# Altium project Control Box.PrjPcb
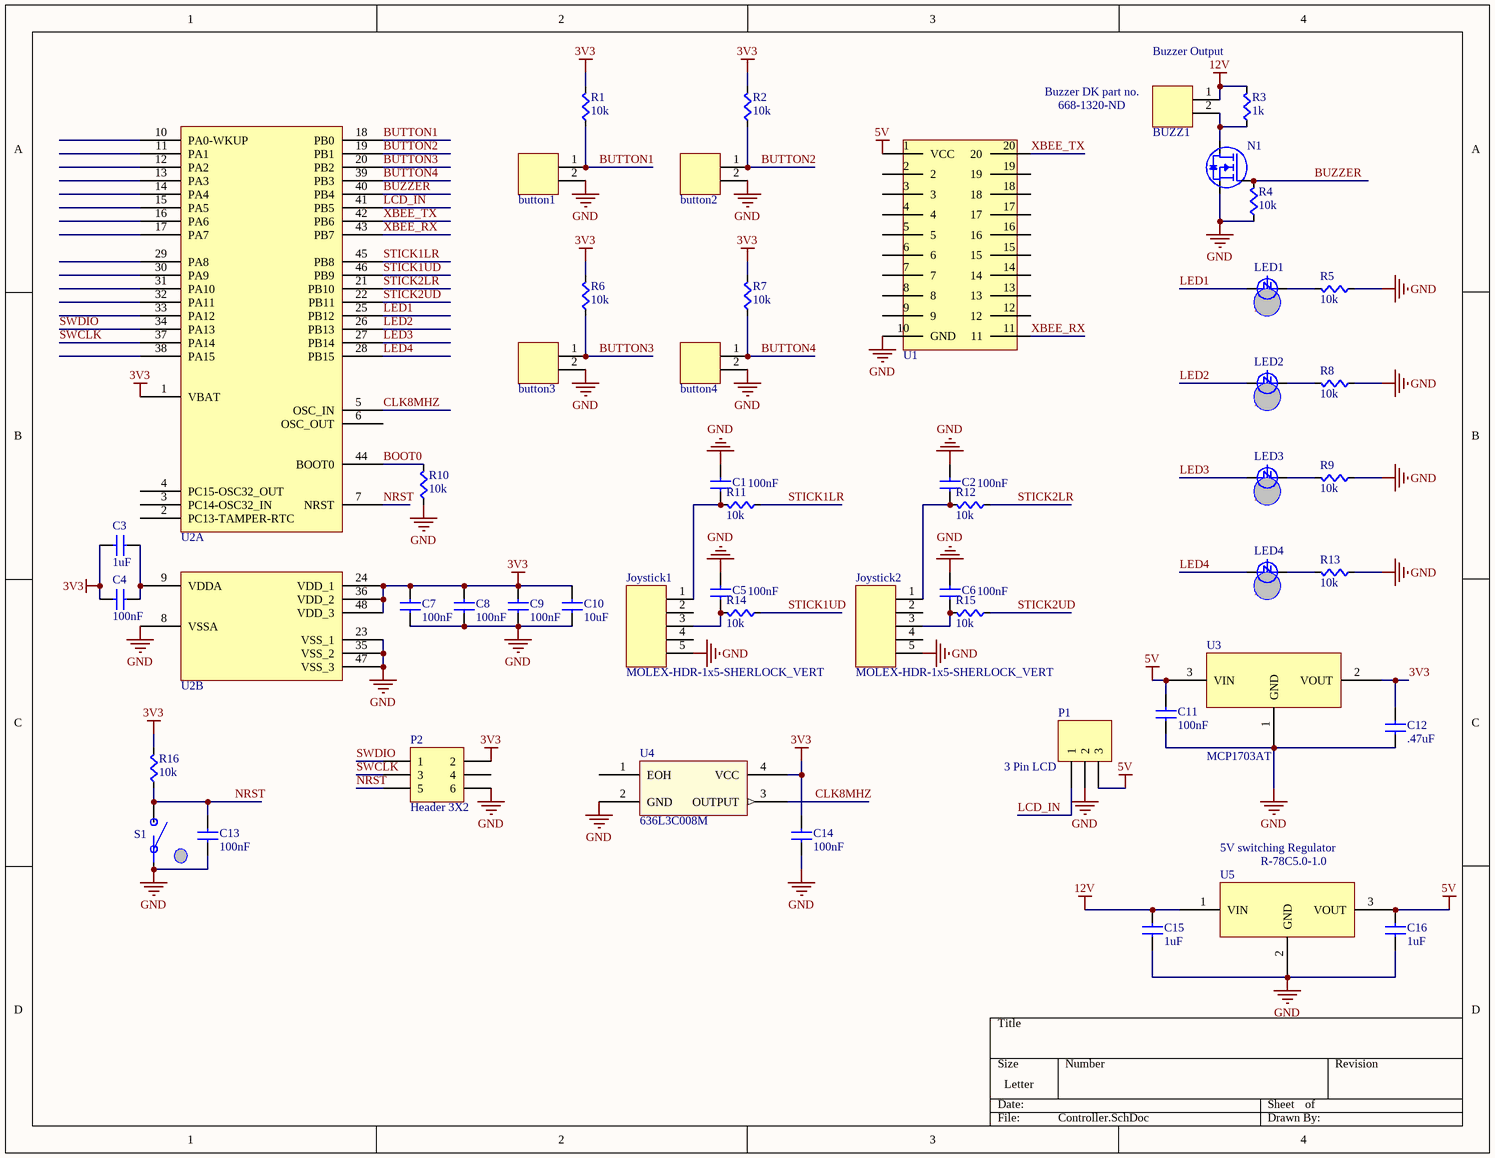
[diagram p0: Controller.SchDoc]
1 sheet, 52 parts. Net scope: global (net labels, ports and power ports of the same name join across sheets).
Board file: Controller.PcbDoc

## Sheet Controller.SchDoc
size Letter

### Parts
button1  2-pin Horz Sherlock  [MOLEX-HDR-1X2-SHERLOCK-HORZ]  (value not drawn)
button2  2-pin Horz Sherlock  [MOLEX-HDR-1X2-SHERLOCK-HORZ]  (value not drawn)
button3  2-pin Horz Sherlock  [MOLEX-HDR-1X2-SHERLOCK-HORZ]  (value not drawn)
button4  2-pin Horz Sherlock  [MOLEX-HDR-1X2-SHERLOCK-HORZ]  (value not drawn)
BUZZ1  2-pin Horz Sherlock  [MOLEX-HDR-1X2-SHERLOCK-HORZ]  (value not drawn)
C1  value 100nF  [CAPC0603]  (hidden comment: Cap)
C2  value 100nF  [CAPC0603]  (hidden comment: Cap)
C3  value 1uF  [CAPC0603]  (hidden comment: Cap)
C4  value 100nF  [CAPC0603]  (hidden comment: Cap)
C5  value 100nF  [CAPC0603]  (hidden comment: Cap)
C6  value 100nF  [CAPC0603]  (hidden comment: Cap)
C7  value 100nF  [CAPC0603]  (hidden comment: Cap)
C8  value 100nF  [CAPC0603]  (hidden comment: Cap)
C9  value 100nF  [CAPC0603]  (hidden comment: Cap)
C10  value 10uF  [CAPC1206]  (hidden comment: Cap)
C11  value 100nF  [CAPC1206]  (hidden comment: Cap)
C12  value .47uF  [CAPC1206]  (hidden comment: Cap)
C13  value 100nF  [CAPC0603]  (hidden comment: Cap)
C14  value 100nF  [CAPC0603]  (hidden comment: Cap)
C15  value 1uF  [CAPC1206]  (hidden comment: Cap)
C16  value 1uF  [CAPC1206]  (hidden comment: Cap)
Joystick1  MOLEX-HDR-1x5-SHERLOCK_VERT  [MOLEX-HDR-1X5-SHERLOCK-VERT]
Joystick2  MOLEX-HDR-1x5-SHERLOCK_VERT  [MOLEX-HDR-1X5-SHERLOCK-VERT]
LED1  Color: Red  [LED0603]  (hidden comment: LED)
LED2  Color: Red  [LED0603]  (hidden comment: LED)
LED3  Color: Red  [LED0603]  (hidden comment: LED)
LED4  Color: Red  [LED0603]  (hidden comment: LED)
N1  NMOSFET  [2N7002P,215]  (value not drawn)
P1  3 Pin LCD  [HDR1X3]
P2  Header 3X2  [HDR2X3]
R1  value 10k  [RES0603]  (hidden comment: Res)
R2  value 10k  [RES0603]  (hidden comment: Res)
R3  value 1k  [RES0603]  (hidden comment: Res)
R4  value 10k  [RES0603]  (hidden comment: Res)
R5  value 10k  [RES0603]  (hidden comment: Res)
R6  value 10k  [RES0603]  (hidden comment: Res)
R7  value 10k  [RES0603]  (hidden comment: Res)
R8  value 10k  [RES0603]  (hidden comment: Res)
R9  value 10k  [RES0603]  (hidden comment: Res)
R10  value 10k  [RES0603]  (hidden comment: Res)
R11  value 10k  [RES0603]  (hidden comment: Res)
R12  value 10k  [RES0603]  (hidden comment: Res)
R13  value 10k  [RES0603]  (hidden comment: Res)
R14  value 10k  [RES0603]  (hidden comment: Res)
R15  value 10k  [RES0603]  (hidden comment: Res)
R16  value 10k  [RES0603]  (hidden comment: Res)
S1  Button  [PTS645xxxxSMTR92]  (value not drawn)
U1  XBee  [XBee]  (value not drawn)
U2  STM32F103C8T7  [STM32F103C8T7]  (value not drawn)  (parts A,B of 2)
U3  MCP1703AT  [MCP1703AT-xx02EDB]
U4  636L3C008M  [636L3C]
U5  R-78C5.0-1.0  [R-78C5.0-1.0]

### Nets
3V3: C3.2(B) C4.2(B) C7.1(A) C8.1(A) C9.1(A) C10.2(B) C12.1(A) C14.1(A) P2.2 R1.1(A) R2.1(A) R6.1(A) R7.1(A) R16.1(A) U2.1(VBAT) U2.24(VDD_1) U2.36(VDD_2) U2.48(VDD_3) U3.2(VOUT) U4.4(VCC)
5V: C11.1(A) C16.1(A) P1.3 U1.1(VCC) U3.3(VIN) U5.3(VOUT)
12V: BUZZ1.1 C15.1(A) R3.1(A) U5.1(VIN)
GND: button1.2 button2.2 button3.2 button4.2 C1.1(A) C2.1(A) C5.1(A) C6.1(A) C7.2(B) C8.2(B) C9.2(B) C10.1(A) C11.2(B) C12.2(B) C13.2(B) C14.2(B) C15.2(B) C16.2(B) Joystick1.5 Joystick2.5 N1.2(S) P1.2 P2.6 R4.2(B) R5.2(B) R8.2(B) R9.2(B) R10.2(B) R13.2(B) S1.A U1.10(GND) U2.8(VSSA) U2.23(VSS_1) U2.35(VSS_2) U2.47(VSS_3) U3.1(GND) U4.2(GND) U5.2(GND)
BOOT0: R10.1(A) U2.44(BOOT0)
BUTTON1: button1.1 R1.2(B) U2.18(PB0)
BUTTON2: button2.1 R2.2(B) U2.19(PB1)
BUTTON3: button3.1 R6.2(B) U2.20(PB2)
BUTTON4: button4.1 R7.2(B) U2.39(PB3)
BUZZER: N1.1(G) R4.1(A) U2.40(PB4)
CLK8MHZ: U2.5(OSC_IN) U4.3(OUTPUT)
LCD_IN: P1.1 U2.41(PB5)
LED1: LED1.A U2.25(PB12)
LED2: LED2.A U2.26(PB13)
LED3: LED3.A U2.27(PB14)
LED4: LED4.A U2.28(PB15)
NRST: C13.1(A) P2.5 R16.2(B) S1.B U2.7(NRST)
STICK1LR: R11.2(B) U2.45(PB8)
STICK1UD: R14.2(B) U2.46(PB9)
STICK2LR: R12.2(B) U2.21(PB10)
STICK2UD: R15.2(B) U2.22(PB11)
SWCLK: P2.3 U2.37(PA14)
SWDIO: P2.1 U2.34(PA13)
XBEE_RX: U1.11 U2.43(PB7)
XBEE_TX: U1.20 U2.42(PB6)
NetBUZZ1_2: BUZZ1.2 N1.3(D) R3.2(B)
NetC1_2: C1.2(B) Joystick1.1 R11.1(A)
NetC2_2: C2.2(B) Joystick2.1 R12.1(A)
NetC3_1: C3.1(A) C4.1(A) U2.9(VDDA)
NetC5_2: C5.2(B) Joystick1.3 R14.1(A)
NetC6_2: C6.2(B) Joystick2.3 R15.1(A)
NetLED1_C: LED1.C R5.1(A)
NetLED2_C: LED2.C R8.1(A)
NetLED3_C: LED3.C R9.1(A)
NetLED4_C: LED4.C R13.1(A)

Not connected (* = marked no-connect by the designer): Joystick1 2 4; Joystick2 2 4; P2 4; U1 2 3 4 5 6 7 8 9 12 13 14 15 16 17 18 19; U2 2(PC13-TAMPER-RTC) 3(PC14-OSC32_IN) 4(PC15-OSC32_OUT) 6(OSC_OUT) 10(PA0-WKUP) 11(PA1) 12(PA2) 13(PA3) 14(PA4) 15(PA5) 16(PA6) 17(PA7) 29(PA8) 30(PA9) 31(PA10) 32(PA11) 33(PA12) 38(PA15); U4 1(EOH)

### Notes on the sheet
- (near BUZZ1) Buzzer DK part no.
- Buzzer Output
- 668-1320-ND
- 5V switching Regulator

### Library data of the parts
button1-button4 BUZZ1 = MOLEX-HDR-1x2-SHERLOCK_RA: Header, Molex, 2mm Pitch Sherlock Header, Single Row, Horizontal, 2 Circuits, Length 3.3mm,  0353630260; Manufacturer: Molex Inc; Manufacturer Part Number: 0353630260; Supplier Part Number: WM18931-ND; Supplier: Digi-Key
Joystick1 Joystick2 = MOLEX-HDR-1x5-SHERLOCK_VERT: Header, Molex, 2mm Pitch Sherlock Header, Single Row, Vertical, 5 Circuits, Length 3.3mm, 0353620550; Manufacturer Part Number: *; Order Part Number: *
N1 = NMOSFET: NMOSFET Template; Supplier 1: Digi-Key; Supplier Part Number 1: 568-5818-1-ND
P1 = Header 3: NHD-0420D3Z-NSW-BBW-V3-ND; LatestRevisionDate: 17-Jul-2002; LatestRevisionNote: Re-released for DXP Platform.; Publisher: Altium Limited
P2 = Header 3X2: Header, 3-Pin, Dual row; LatestRevisionDate: 17-Jul-2002; LatestRevisionNote: Re-released for DXP Platform.; Publisher: Altium Limited
S1 = Button: SPST Button; Supplier 1: Digi-Key; Supplier Part Number 1: CKN9087CT-ND
U1 = XBee: XBee radio; Supplier 1: Digi-Key; Supplier Part Number 1: 602-1181-ND
U2 = STM32F103C8T7: MCU ARM 32BIT 64K FLASH 48-LQFP; Supplier 1: Digi-Key; Supplier Part Number 1: 497-11517-ND
U3 = MCP1703AT: 250 mA, 16V, Low Quiescent Current LDO Regulator; Supplier 1: Digi-Key; Supplier Part Number 1: MCP1703AT-3302E/CBCT-ND
U4 = 636L3C: HCMOS/TTL Clock Oscillator; Supplier 1: Digi-Key; Supplier Part Number 1: CTX1005CT-ND
U5 = R-78C5.0-1.0: CONV DC/DC 1A 5V OUT SIP VERT; Supplier 1: Digi-Key; Supplier Part Number 1: 945-1395-5-ND
C1-C16 = Cap: Supplier 1: Digi-Key
  C1-C9 C11 C13 C14: Supplier Part Number 1: 1276-1000-1-ND
  C10: Supplier Part Number 1: 1276-2876-1-ND
  C12: Supplier Part Number 1: 445-7465-1-ND
  C15 C16: Supplier Part Number 1: 1276-1860-1-ND
LED1-LED4 = LED: Supplier 1: Digi-Key; Supplier Part Number 1: 754-1122-1-ND
R1-R16 = Res: Supplier 1: Digi-Key
  R1 R2 R4-R16: Supplier Part Number 1: RMCF0603JT10K0CT-ND
  R3: Supplier Part Number 1: RMCF0603JT1K00CT-ND